# EAGLE design gate-controller (EAGLE 7.6.0)
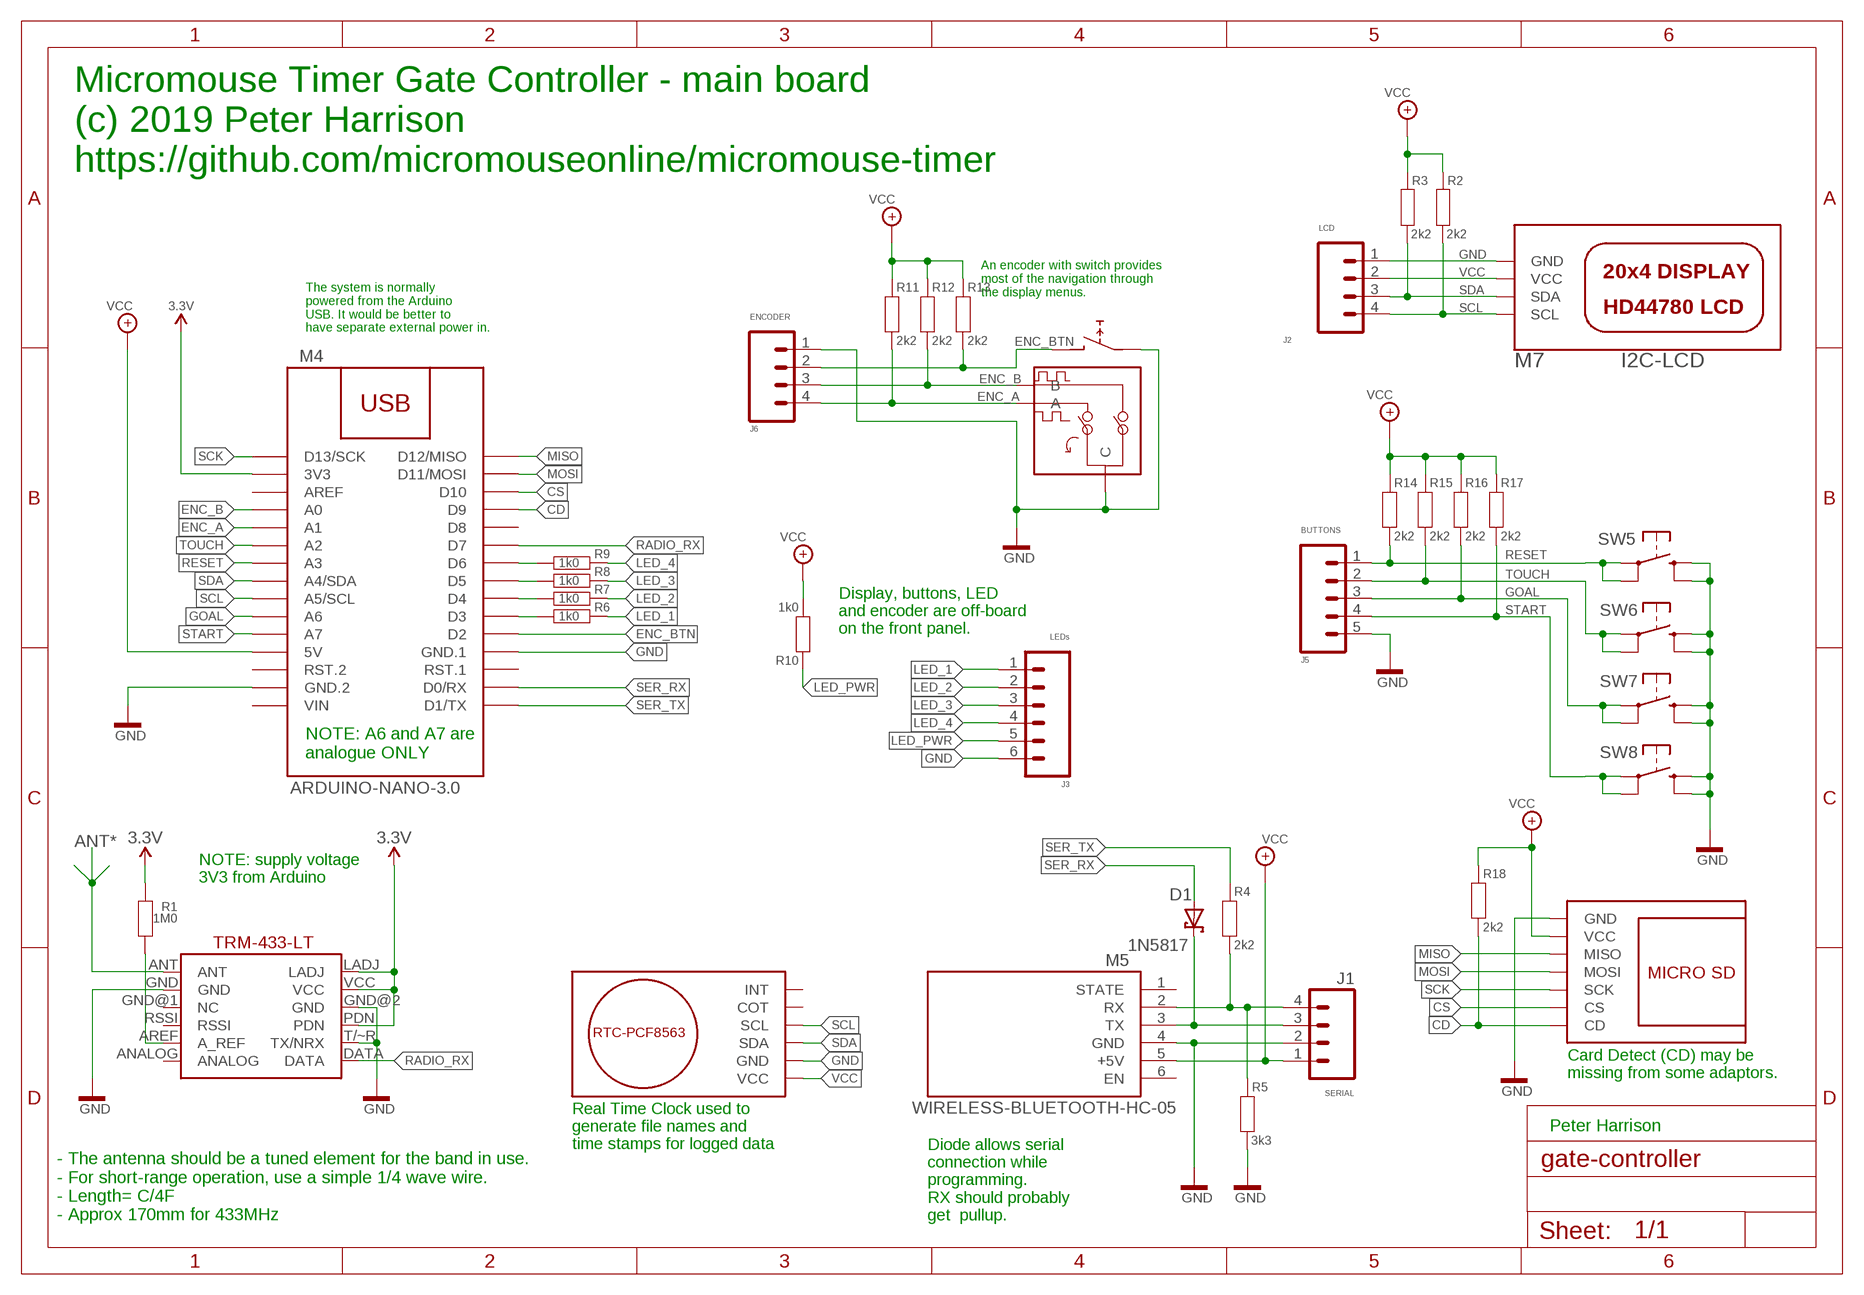
[diagram p0: schematic, sheet 1]
FRAME1 (A4L-LOC): NME: Peter Harrison

## Parts
D1  1N5817  SCHOTTKY-DIODEDO35-7  [DO35-7]
J1  SERIAL  M04PTH  [1X04]
J2  LCD  M04PTH  [1X04]
J3  LEDs  M06SIP  [1X06]
J5  BUTTONS  M05PTH  [1X05]
J6  ENCODER  M04PTH  [1X04]
M2  RTC-PCF8563  [RTC-PCF8563]
M3  TRM-433-LT  [LINX-TRM-433-LT]
M4  ARDUINO-NANO-3.0  [ARDUINO-NANO-3.0]
M5  WIRELESS-BLUETOOTH-HC-05  [WIRELESS-BLUETOOTH-HC-05]
M6  MICRO-SD-ADAPTOR  [MICRO-SD-ADAPTOR]
M7  I2C-LCD  (no package)
R1  1M0  RESISTOR_AXIAL-0207_0.4  [AXIAL-0207_0.4]
R2  2k2  RESISTOR_AXIAL-0207_0.4  [AXIAL-0207_0.4]
R3  2k2  RESISTOR_AXIAL-0207_0.4  [AXIAL-0207_0.4]
R4  2k2  RESISTOR_AXIAL-0207_0.4  [AXIAL-0207_0.4]
R5  3k3  RESISTOR_AXIAL-0207_0.4  [AXIAL-0207_0.4]
R6  1k0  RESISTOR_AXIAL-0207_0.4  [AXIAL-0207_0.4]
R7  1k0  RESISTOR_AXIAL-0207_0.4  [AXIAL-0207_0.4]
R8  1k0  RESISTOR_AXIAL-0207_0.4  [AXIAL-0207_0.4]
R9  1k0  RESISTOR_AXIAL-0207_0.4  [AXIAL-0207_0.4]
R10  1k0  RESISTOR_AXIAL-0207_0.4  [AXIAL-0207_0.4]
R11  2k2  RESISTOR_AXIAL-0207_0.4  [AXIAL-0207_0.4]
R12  2k2  RESISTOR_AXIAL-0207_0.4  [AXIAL-0207_0.4]
R13  2k2  RESISTOR_AXIAL-0207_0.4  [AXIAL-0207_0.4]
R14  2k2  RESISTOR_AXIAL-0207_0.4  [AXIAL-0207_0.4]
R15  2k2  RESISTOR_AXIAL-0207_0.4  [AXIAL-0207_0.4]
R16  2k2  RESISTOR_AXIAL-0207_0.4  [AXIAL-0207_0.4]
R17  2k2  RESISTOR_AXIAL-0207_0.4  [AXIAL-0207_0.4]
R18  2k2  RESISTOR_AXIAL-0207_0.4  [AXIAL-0207_0.4]
SW5  ARCADE_BUTTON_24MM  (no package)
SW6  ARCADE_BUTTON_24MM  (no package)
SW7  ARCADE_BUTTON_24MM  (no package)
SW8  ARCADE_BUTTON_24MM  (no package)
U$2  EC12_SW  (no package)

## Nets
3V3: M3.LADJ M3.PDN M3.VCC M4.3V3 R1.2 ; supply symbol labelled 3.3V
ANT*: M3.ANT
CD: M4.D9 M6.CD R18.1
CS: M4.D10 M6.CS
D3: M4.D3 R6.2
D4: M4.D4 R7.2
D5: M4.D5 R8.2
D6: M4.D6 R9.2
ENC_A: J6.4 M4.A1 R11.1 U$2.A
ENC_B: J6.3 M4.A0 R12.1 U$2.B
ENC_BTN: J6.2 M4.D2 R13.1 U$2.E
GND: J1.2 J2.1 J3.6 J5.5 J6.1 M2.GND M3.GND M3.GND@2(GND) M3.T/~R(TX/NRX) M4.GND@1(GND.2) M4.GND@2(GND.1) M5.4(GND) M6.GND M7.GND R5.1 SW5.3 SW5.4 SW6.3 SW6.4 SW7.3 SW7.4 SW8.3 SW8.4 U$2.C U$2.D
GOAL: J5.3 M4.A6 R16.1 SW7.1 SW7.2
LED_1: J3.1 R6.1
LED_2: J3.2 R7.1
LED_3: J3.3 R8.1
LED_4: J3.4 R9.1
LED_PWR: J3.5 R10.2
MISO: M4.D12(D12/MISO) M6.MISO
MOSI: M4.D11(D11/MOSI) M6.MOSI
N$8: M3.AREF(A_REF) R1.1
N$14: J1.4 M5.2(RX) R4.1 R5.2
N$34: D1.C J1.3 M5.3(TX)
RADIO_RX: M3.DATA M4.D7
RESET: J5.1 M4.A3 R14.1 SW5.1 SW5.2
SCK: M4.D13(D13/SCK) M6.SCK
SCL: J2.4 M2.SCL M4.A5(A5/SCL) M7.SCL R2.1
SDA: J2.3 M2.SDA M4.A4(A4/SDA) M7.SDA R3.1
SER_RX: D1.A M4.RX0(D0/RX)
SER_TX: M4.TX1(D1/TX) R4.2
START: J5.4 M4.A7 R17.1 SW8.1 SW8.2
TOUCH: J5.2 M4.A2 R15.1 SW6.1 SW6.2
VCC: J1.1 J2.2 M2.VCC M4.5V M5.5(+5V) M6.VCC M7.VCC R2.2 R3.2 R10.1 R11.2 R12.2 R13.2 R14.2 R15.2 R16.2 R17.2 R18.2
Unconnected: M2.COT M2.INT M3.ANALOG M3.GND@1(NC) M3.RSSI M4.AREF M4.D8 M4.RST@1(RST.2) M4.RST@2(RST.1) M5.1(STATE) M5.6(EN)

## Notes on the sheet
- Micromouse Timer Gate Controller - main board
  (c) 2019 Peter Harrison
  https://github.com/micromouseonline/micromouse-timer
- An encoder with switch provides 
  most of the navigation through 
  the display menus.
- The system is normally 
  powered from the Arduino 
  USB. It would be better to 
  have separate external power in.
- Display, buttons, LED
  and encoder are off-board
  on the front panel.
- NOTE: A6 and A7 are
  analogue ONLY
- NOTE: supply voltage 
  3V3 from Arduino
- Card Detect (CD) may be 
  missing from some adaptors.
- Real Time Clock used to
  generate file names and
  time stamps for logged data
- - The antenna should be a tuned element for the band in use.
  - For short-range operation, use a simple 1/4 wave wire.
  - Length= C/4F
  - Approx 170mm for 433MHz
- Diode allows serial 
  connection while 
  programming.
  RX should probably 
  get  pullup.

## Power pins joined to a net without a drawn wire
VIN: M4.VIN

## Library data of the parts
D1 = micromouse-timer:SCHOTTKY-DIODE: Schottky Diode
J1 J2 J6 = micromouse-timer:M04: Header 4 Standard 4-pin 0.1" header. Use with straight break away headers (SKU : PRT-00116), right angle break away headers (PRT-00553), swiss pins (PRT-00743), machine pins (PRT-00117), and female headers (PRT-00115). Molex polarized connector foot print use with SKU : PRT-08231 with associated crimp pins and housings. 1MM SMD Version SKU: PRT-10208
J3 = micromouse-timer:M06: Header 6 Standard 6-pin 0.1" header. Use with straight break away headers (SKU : PRT-00116), right angle break away headers (PRT-00553), swiss pins (PRT-00743), machine pins (PRT-00117), and female headers (PRT-00115). Molex polarized connector foot print use with SKU : PRT-08094 with associated crimp pins and housings. NOTES ON THE VARIANTS LOCK and LOCK_LONGPADS... This footprint was designed to help hold the alignment of a through-hole component (i.e. 6-pin header) while soldering it into place. You may notice that each hole has been shifted either up or down by 0.005 of an inch from it's more standard position (which is a perfectly straight line). This slight alteration caused the pins (the squares in the middle) to touch the edges of the holes. Because they are alternating, it causes a "brace" to hold the component in place. 0.005 has proven to be the perfect amount of "off-center" position when using our standard breakaway headers. Although looks a little odd when you look at the bare footprint, once you have a header in there, the alteration is very hard to notice. Also, if you push a header all the way into place, it is covered up entirely on the bottom side. This idea of altering the position of holes to aid alignment will be further integrated into the Sparkfun Library for other footprints. It can help hold any component with 3 or more connection pins.
J5 = micromouse-timer:M05: Header 5 Standard 5-pin 0.1" header. Use with straight break away headers (SKU : PRT-00116), right angle break away headers (PRT-00553), swiss pins (PRT-00743), machine pins (PRT-00117), and female headers (PRT-00115). Molex polarized connector foot print use with SKU : PRT-08230 with associated crimp pins and housings.
M2 = micromouse-timer:RTC-PCF8563
M3 = micromouse-timer:TRM-433-LT: LINX 433 MHz Tranceiver
M4 = micromouse-timer:ARDUINO-NANO-3.0: Arduino Nano 3.0 and compatible devices More details available here: https://www.arduino.cc/en/Main/ArduinoBoardNano Click here to find device on ebay.com <http://www.ebay.com/sch/arduino+nano>
M5 = micromouse-timer:WIRELESS-BLUETOOTH-HC-05: Bluetooth Transceiver Module based on HC-05 board Tutorial is available here: https://arduino-info.wikispaces.com/BlueTooth-HC05-HC06-Modules-How-To Click here to find device on ebay.com <http://www.ebay.com/sch/hc-05+module+rs232>
M6 = micromouse-timer:MICRO-SD-ADAPTOR
M7 = micromouse-timer:I2C-LCD
R1-R18 = micromouse-timer:RESISTOR_: Resistor Basic schematic elements and footprints for 0603, 1206, and PTH 1/10th watt (small) resistors.
SW5-SW8 = micromouse-timer:ARCADE_BUTTON_24MM
U$2 = micromouse-timer:EC12_SW

## Board
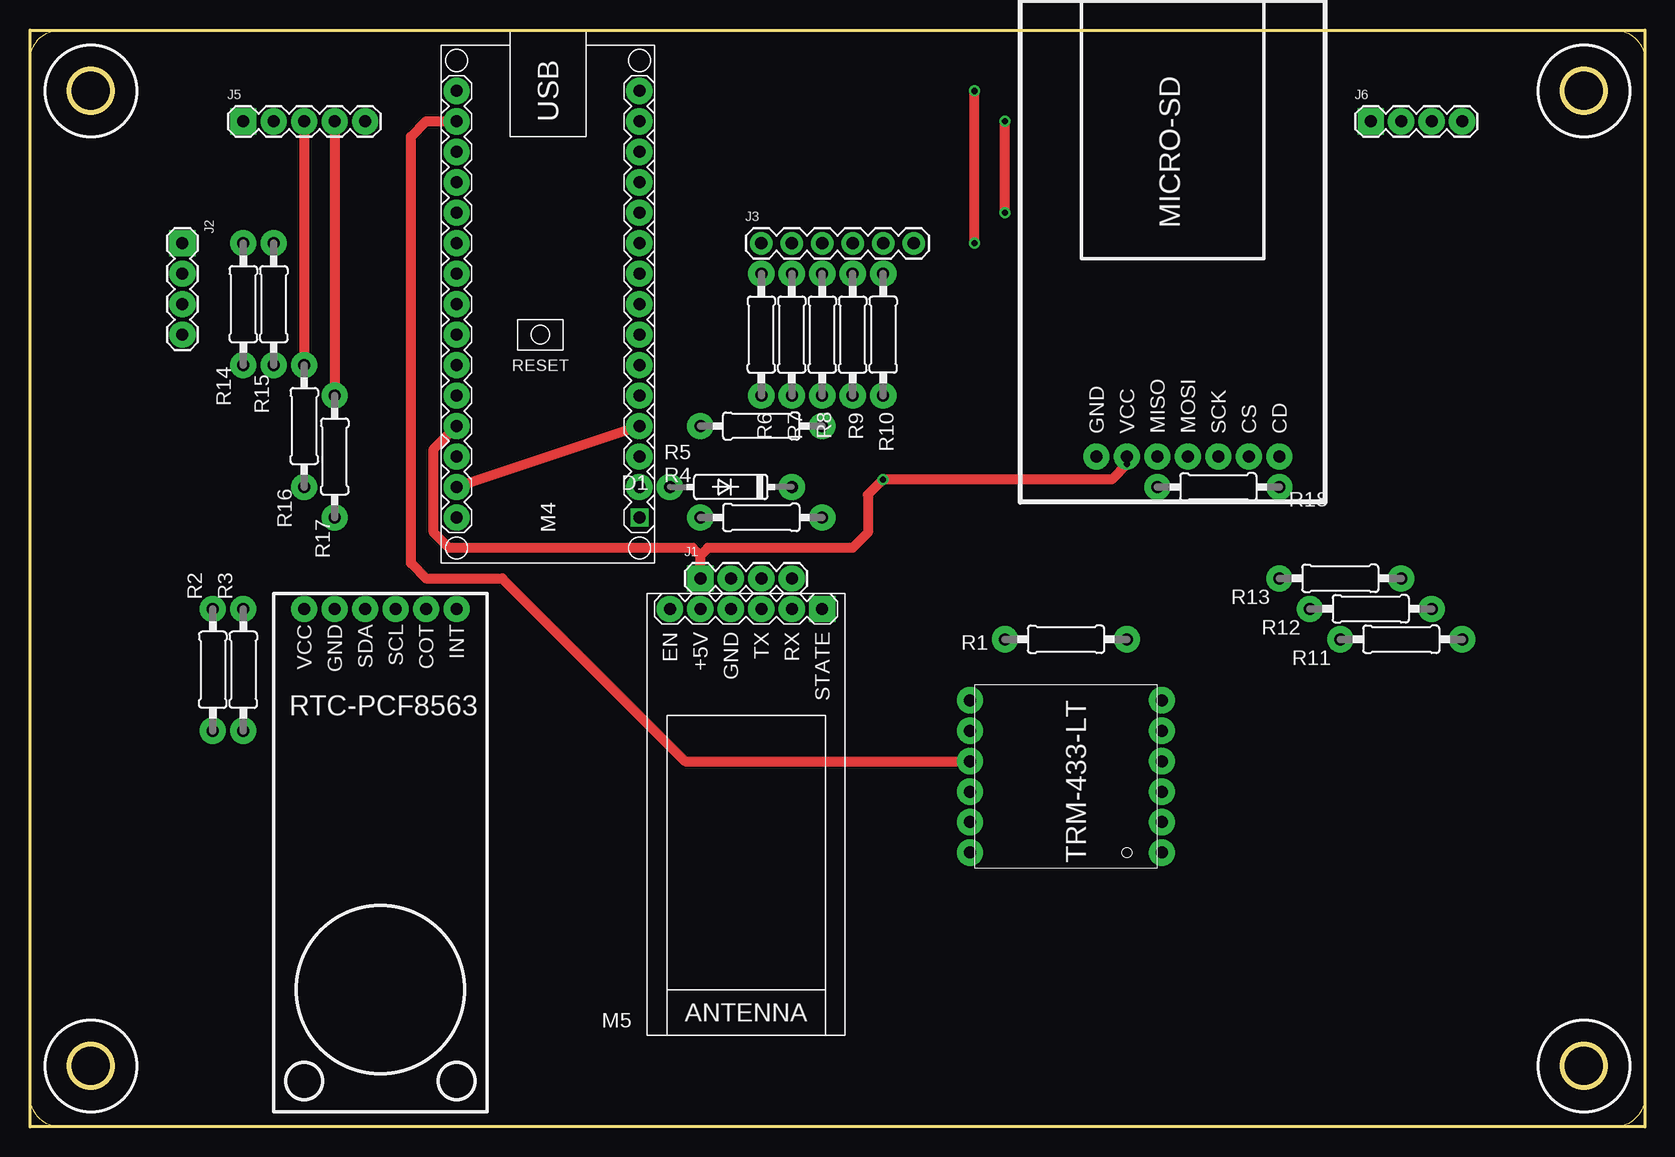
[diagram p1: board, top side]
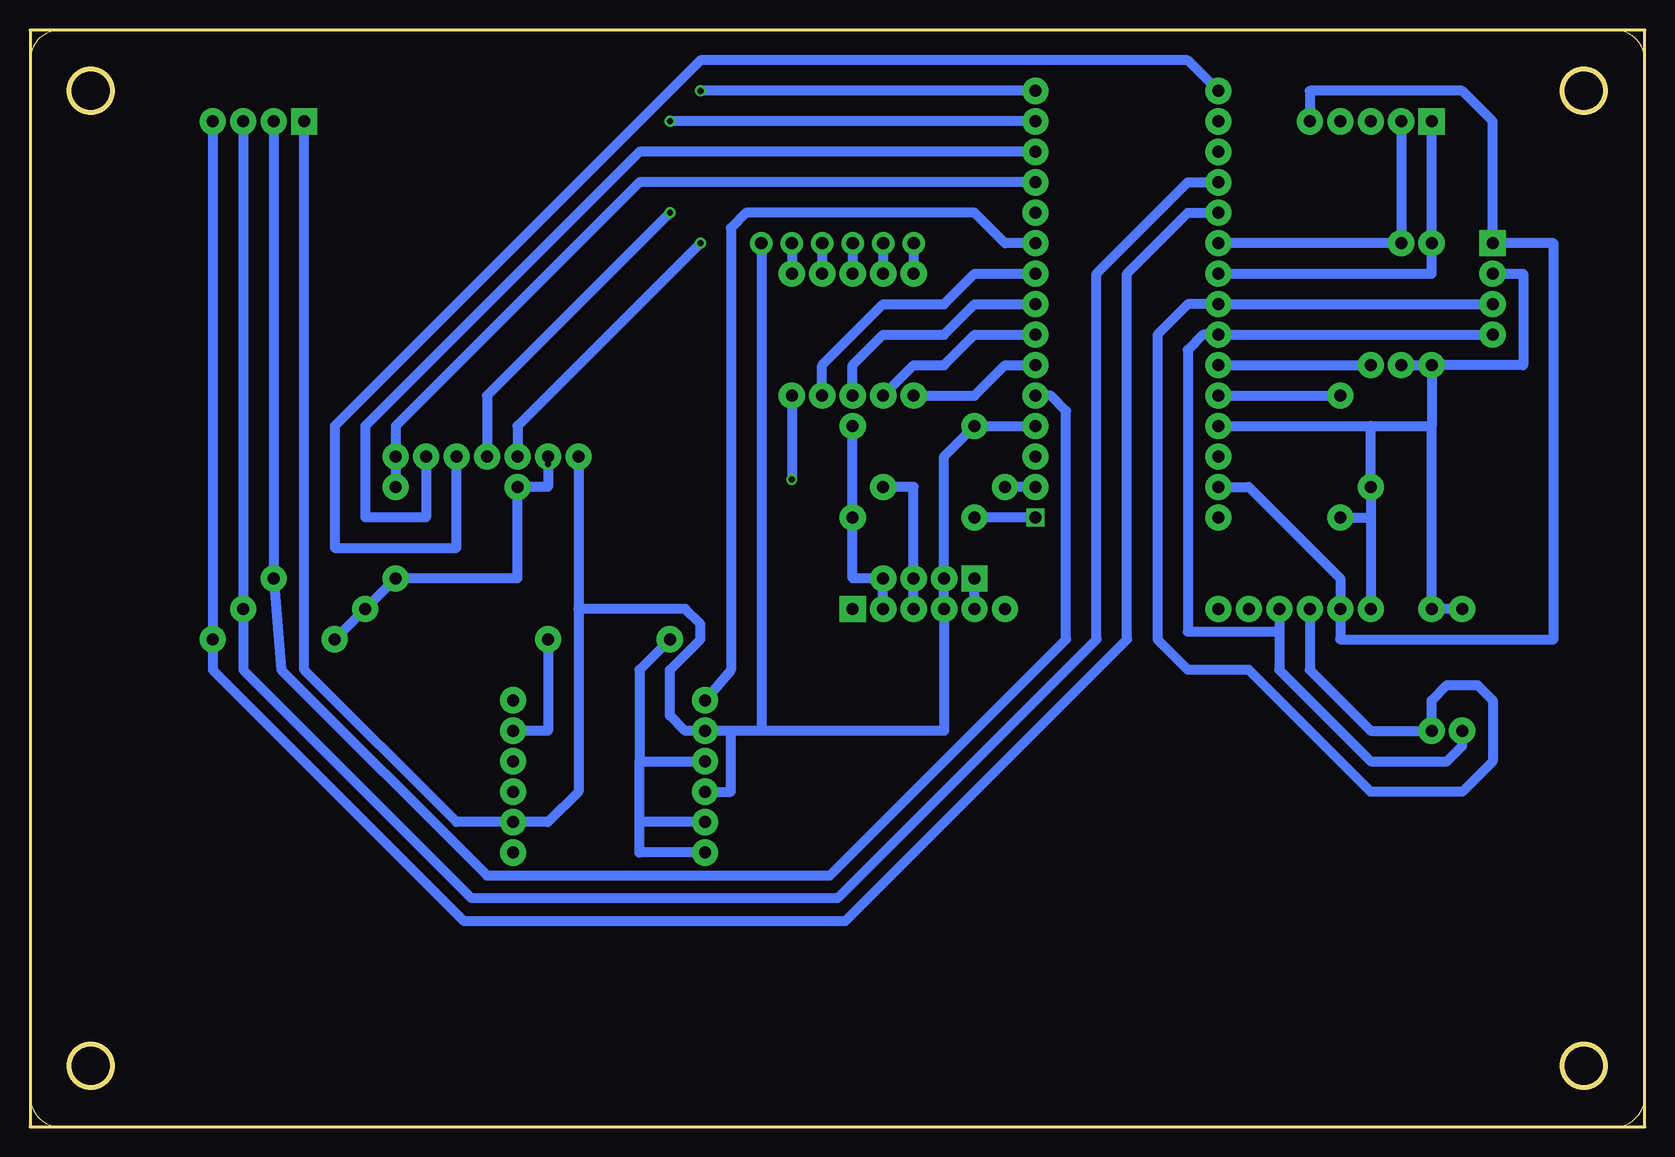
[diagram p2: board, bottom side, seen from below]

Size 134.62 x 91.44 mm. Coordinates in mm from the lower left corner, seen from the top.
Outline: 0,0 0,91.44 134.62,91.44 134.62,0 0,0
Copper layers (1*16): Top 0.035mm / dielectric 1.5mm / Bottom 0.035mm
Design rules "milling": minimum track width 10mil, minimum drill 24mil, track to track 20mil, track to pad 20mil, pad to pad 20mil, via to via 20mil, smd to smd 20mil, copper to edge 40mil, drill to drill 20mil, minimum pad ring 10mil, minimum via ring 8mil, stop-mask expansion 4mil, vias tented up to drill 0mil, thermal gap 10mil
Milling: area 3.3,84.6 to 6.9,88.2; area 3.3,3.3 to 6.9,6.9; area 127.7,3.3 to 131.3,6.9; area 127.7,84.6 to 131.3,88.2; 8 lines

### Footprints (pad centres in the part's own frame; a part is rotated, then mirrored left to right if it is on the bottom)
DO35-7 = drill 1 pad 2.184: A 5.08,0; C -5.08,0
1X04 = drill 1 pad 2.184 square: 1 0,0 | drill 1 pad 2.184: 2 2.54,0; 3 5.08,0; 4 7.62,0
1X06 = drill 1.016 pad 1.88: 1 0,0; 2 2.54,0; 3 5.08,0; 4 7.62,0; 5 10.16,0; 6 12.7,0
1X05 = drill 1 pad 2.184 square: 1 0,0 | drill 1 pad 2.184: 2 2.54,0; 3 5.08,0; 4 7.62,0; 5 10.16,0
RTC-PCF8563 = drill 1 pad 2.184: COT 1.27,3.81; GND 1.27,-3.81; INT 1.27,6.35; SCL 1.27,1.27; SDA 1.27,-1.27; VCC 1.27,-6.35
LINX-TRM-433-LT = drill 1 pad 2.184: ANALOG -8,-5.08; ANT -8,7.62; AREF -8,-2.54; DATA 8,-5.08; GND -8,5.08; GND@1 -8,2.54; GND@2 8,2.54; LADJ 8,7.62; PDN 8,0; RSSI -8,0; T/~R 8,-2.54; VCC 8,5.08
ARDUINO-NANO-3.0 = drill 1 pad 2.184: 3V3 -15.24,-7.62; 5V 10.16,-7.62; A0 -10.16,-7.62; A1 -7.62,-7.62; A2 -5.08,-7.62; A3 -2.54,-7.62; A4 0,-7.62; A5 2.54,-7.62; A6 5.08,-7.62; A7 7.62,-7.62; AREF -12.7,-7.62; D2 7.62,7.62; D3 5.08,7.62; D4 2.54,7.62; D5 0,7.62; D6 -2.54,7.62; D7 -5.08,7.62; D8 -7.62,7.62; D9 -10.16,7.62; D10 -12.7,7.62; D11 -15.24,7.62; D12 -17.78,7.62; D13 -17.78,-7.62; GND@1 15.24,-7.62; GND@2 10.16,7.62; RST@1 12.7,-7.62; RST@2 12.7,7.62; RX0 15.24,7.62; VIN 17.78,-7.62 | drill 1 square: TX1 17.78,7.62
WIRELESS-BLUETOOTH-HC-05 = drill 1 pad 2.184 square: 1 -6.35,-17.145 | drill 1 pad 2.184: 2 -3.81,-17.145; 3 -1.27,-17.145; 4 1.27,-17.145; 5 3.81,-17.145; 6 6.35,-17.145
MICRO-SD-ADAPTOR = drill 1 pad 2.184: CD -7.62,-8.89; CS -7.62,-6.35; GND -7.62,6.35; MISO -7.62,1.27; MOSI -7.62,-1.27; SCK -7.62,-3.81; VCC -7.62,3.81
AXIAL-0207_0.4 = drill 1 pad 2.184: 1 -5.08,0; 2 5.08,0

### Placement (x,y rotation side)
D1  58.42,53.34 180 top
J1  55.88,45.72 0 top
J2  12.7,73.66 270 top
J3  60.96,73.66 0 top
J5  17.78,83.82 0 top
J6  111.76,83.82 0 top
M2  29.21,44.45 270 top
M3  86.36,30.48 180 top
M4  43.18,68.58 270 top
M5  59.69,26.04 180 top
M6  95.25,63.5 90 top
R1  86.36,40.64 180 top
R2  15.24,38.1 90 top
R3  17.78,38.1 90 top
R4  60.96,50.8 180 top
R5  60.96,58.42 0 top
R6  60.96,66.04 270 top
R7  63.5,66.04 270 top
R8  66.04,66.04 270 top
R9  68.58,66.04 270 top
R10  71.12,66.04 90 top
R11  114.3,40.64 180 top
R12  111.76,43.18 180 top
R13  109.22,45.72 180 top
R14  17.78,68.58 270 top
R15  20.32,68.58 270 top
R16  22.86,58.42 270 top
R17  25.4,55.88 270 top
R18  99.06,53.34 180 top

### Tracks (layer width: path | path; a pad name or v marks a point on that pad's centre or on a via)
3V3
  Top 0.813: M3.PDN 54.61,30.48 39.37,45.72 33.02,45.72 31.75,46.99 31.75,82.55 33.02,83.82 M4.3V3
  Bottom 0.813: R1.2 83.82,38.1 83.82,30.48 | 83.82,30.48 M3.PDN | M3.LADJ 83.82,22.86 83.82,25.4 | 83.82,25.4 83.82,30.48 | M3.VCC 83.82,25.4
CD
  Bottom 0.813: R18.1 M6.CD 104.14,58.42 83.82,78.74 M4.D9
CS
  Bottom 0.813: M6.CS 101.6,50.8 106.68,50.8 106.68,58.42 83.82,81.28 M4.D10
D3
  Bottom 0.813: R6.2 55.88,60.96 53.34,63.5 M4.D3
D4
  Bottom 0.813: R7.2 60.96,63.5 58.42,63.5 55.88,66.04 52.07,66.04 M4.D4
D5
  Bottom 0.813: R8.2 66.04,63.5 63.5,66.04 58.42,66.04 55.88,68.58 M4.D5
D6
  Bottom 0.813: R9.2 68.58,63.5 63.5,68.58 58.42,68.58 55.88,71.12 M4.D6
ENC_A
  Bottom 0.813: J6.4 R11.1 119.38,38.1 98.42,17.14 66.67,17.14 43.18,40.64 43.18,71.12 38.1,76.2 M4.A1
ENC_B
  Bottom 0.813: J6.3 R12.1 116.84,38.1 97.79,19.05 67.31,19.05 45.72,40.64 45.72,71.12 38.1,78.74 M4.A0
ENC_BTN
  Bottom 0.813: J6.2 R13.1 113.67,38.1 96.52,20.95 67.94,20.95 48.26,40.64 48.26,59.69 49.53,60.96 M4.D2
GND
  Top 0.813: M4.GND@1 M4.GND@2
  Bottom 0.813: M3.GND@2 76.2,27.94 76.2,33.02 | 76.2,33.02 M3.T/~R 80.01,33.02 81.28,34.29 81.28,38.1 78.74,40.64 78.74,41.91 80.01,43.18 88.9,43.18 | M4.GND@2 R5.1 58.42,55.88 J1.2 M5.4 58.42,33.02 73.66,33.02 | J3.6 73.66,33.02 | 73.66,33.02 76.2,33.02 | M4.GND@1 33.02,53.34 27.94,48.26 25.4,45.72 M2.GND 25.4,40.64 7.62,40.64 7.62,73.66 J2.1 12.7,83.82 15.24,86.36 27.94,86.36 J5.5 | J6.1 111.76,38.1 99.06,25.4 M3.GND 91.44,25.4 88.9,27.94 88.9,43.18 | M6.GND 88.9,43.18
GOAL
  Top 0.813: J5.3 R16.1
  Bottom 0.813: M4.A6 R16.1
LED_1
  Bottom 0.813: J3.1 R6.1
LED_2
  Bottom 0.813: J3.2 R7.1
LED_3
  Bottom 0.813: J3.3 R8.1
LED_4
  Bottom 0.813: J3.4 R9.1
LED_PWR
  Bottom 0.813: J3.5 R10.2
MISO  (via drill 0.51)
  Top 0.813: v78.74,73.66 v78.74,86.36
  Bottom 0.813: M4.D12 v78.74,86.36 | v78.74,73.66 93.98,58.42 M6.MISO
MOSI  (via drill 0.51)
  Top 0.813: v81.28,76.2 v81.28,83.82
  Bottom 0.813: M4.D11 v81.28,83.82 | v81.28,76.2 96.52,60.96 M6.MOSI
N$8
  Bottom 0.813: R1.1 91.44,33.02 M3.AREF
N$14
  Bottom 0.813: M5.2 J1.4 66.04,45.72 R4.1 R5.2
N$34
  Bottom 0.813: M5.3 J1.3 60.96,53.34 D1.C
RADIO_RX
  Bottom 0.813: M4.D7 53.34,73.66 55.88,76.2 74.93,76.2 76.2,74.93 76.2,38.1 M3.DATA
RESET
  Bottom 0.813: M4.A3 17.78,71.12 R14.1 J5.1
SCK
  Bottom 0.813: M4.D13 38.1,88.9 78.74,88.9 109.22,58.42 109.22,48.26 99.06,48.26 M6.SCK
SCL
  Bottom 0.813: J2.4 M4.A5 36.83,66.04 38.1,64.77 38.1,41.27 30.48,41.27 | M2.SCL 30.48,41.27 | 30.48,41.27 30.48,38.1 22.86,30.48 16.51,30.48 15.24,31.75 R2.1
SDA
  Bottom 0.813: J2.3 M4.A4 38.1,68.58 40.64,66.04 40.64,40.64 38.1,38.1 33.02,38.1 22.86,27.94 15.24,27.94 12.7,30.48 12.7,35.56 13.97,36.83 16.51,36.83 17.78,35.56 R3.1 22.86,33.02 27.94,38.1 M2.SDA
SER_RX
  Bottom 0.813: M4.RX0 D1.A
SER_TX
  Bottom 0.813: M4.TX1 R4.2
START
  Top 0.813: J5.4 R17.1
  Bottom 0.813: M4.A7 R17.1
TOUCH
  Bottom 0.813: J5.2 R15.1 M4.A2
VCC  (via drill 0.51)
  Top 0.813: 55.88,47.62 56.52,48.26 68.58,48.26 69.85,49.53 69.85,52.7 v71.12,53.98 90.17,53.98 v91.44,55.24 | J1.1 55.88,47.62 | 55.88,47.62 55.24,48.26 34.92,48.26 33.66,49.53 33.66,56.52 M4.5V
  Bottom 0.813: M5.5 J1.1 | M6.VCC v91.44,55.24 91.44,53.34 R18.2 93.98,45.72 R13.2 R12.2 R11.2 | M4.5V 22.86,58.42 | 22.86,58.42 17.78,58.42 | 17.78,58.42 R3.2 R2.2 | R14.2 17.78,58.42 | 22.86,58.42 R16.2 22.86,50.8 | J2.2 10.16,71.12 10.16,63.5 R14.2 | 22.86,50.8 M2.VCC | R10.1 v71.12,53.98 | R15.2 R14.2 | R17.2 22.86,50.8